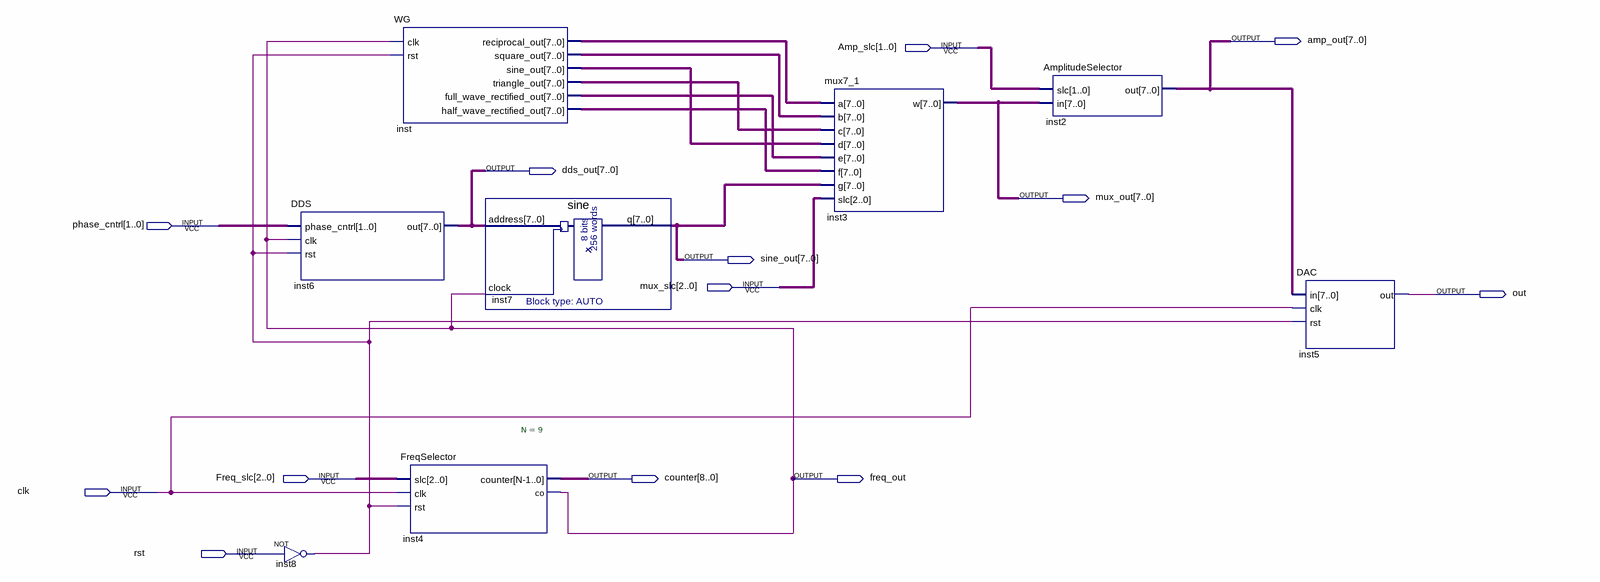
[diagram p0: schematic sheet]
// Quartus schematic AFG.bdf as structural Verilog: 8 symbols, 13 pins
module AFG (
  input  [1:0] Amp_slc,
  input  [1:0] phase_cntrl,
  input  [2:0] mux_slc,
  input  [2:0] Freq_slc,
  input  clk,
  input  rst,
  output [7:0] amp_out,
  output [7:0] dds_out,
  output [7:0] mux_out,
  output [7:0] sine_out,
  output out,
  output [8:0] counter,
  output freq_out
);

  wire inst8_out;
  wire [7:0] inst_full_wave_rectified_out, inst_half_wave_rectified_out, inst_reciprocal_out, inst_sine_out,
       inst_square_out, inst_triangle_out;

  DDS inst6 (.phase_cntrl(phase_cntrl), .clk(freq_out), .rst(inst8_out), .out(dds_out));
  not inst8 (inst8_out, rst);
  WG inst (
    .clk(freq_out), .rst(inst8_out), .reciprocal_out(inst_reciprocal_out), .square_out(inst_square_out),
    .sine_out(inst_sine_out), .triangle_out(inst_triangle_out),
    .full_wave_rectified_out(inst_full_wave_rectified_out),
    .half_wave_rectified_out(inst_half_wave_rectified_out));
  FreqSelector #(.N(9)) inst4 (.slc(Freq_slc), .clk(clk), .rst(inst8_out), .counter(counter), .co(freq_out));
  sine inst7 (.address(dds_out), .clock(freq_out), .q(sine_out));
  mux7_1 inst3 (
    .a(inst_reciprocal_out), .b(inst_square_out), .c(inst_triangle_out), .d(inst_sine_out),
    .e(inst_full_wave_rectified_out), .f(inst_half_wave_rectified_out), .g(sine_out), .slc(mux_slc),
    .w(mux_out));
  AmplitudeSelector inst2 (.slc(Amp_slc), .in(mux_out), .out(amp_out));
  DAC inst5 (.in(amp_out), .clk(clk), .rst(inst8_out), .out(out));
endmodule
